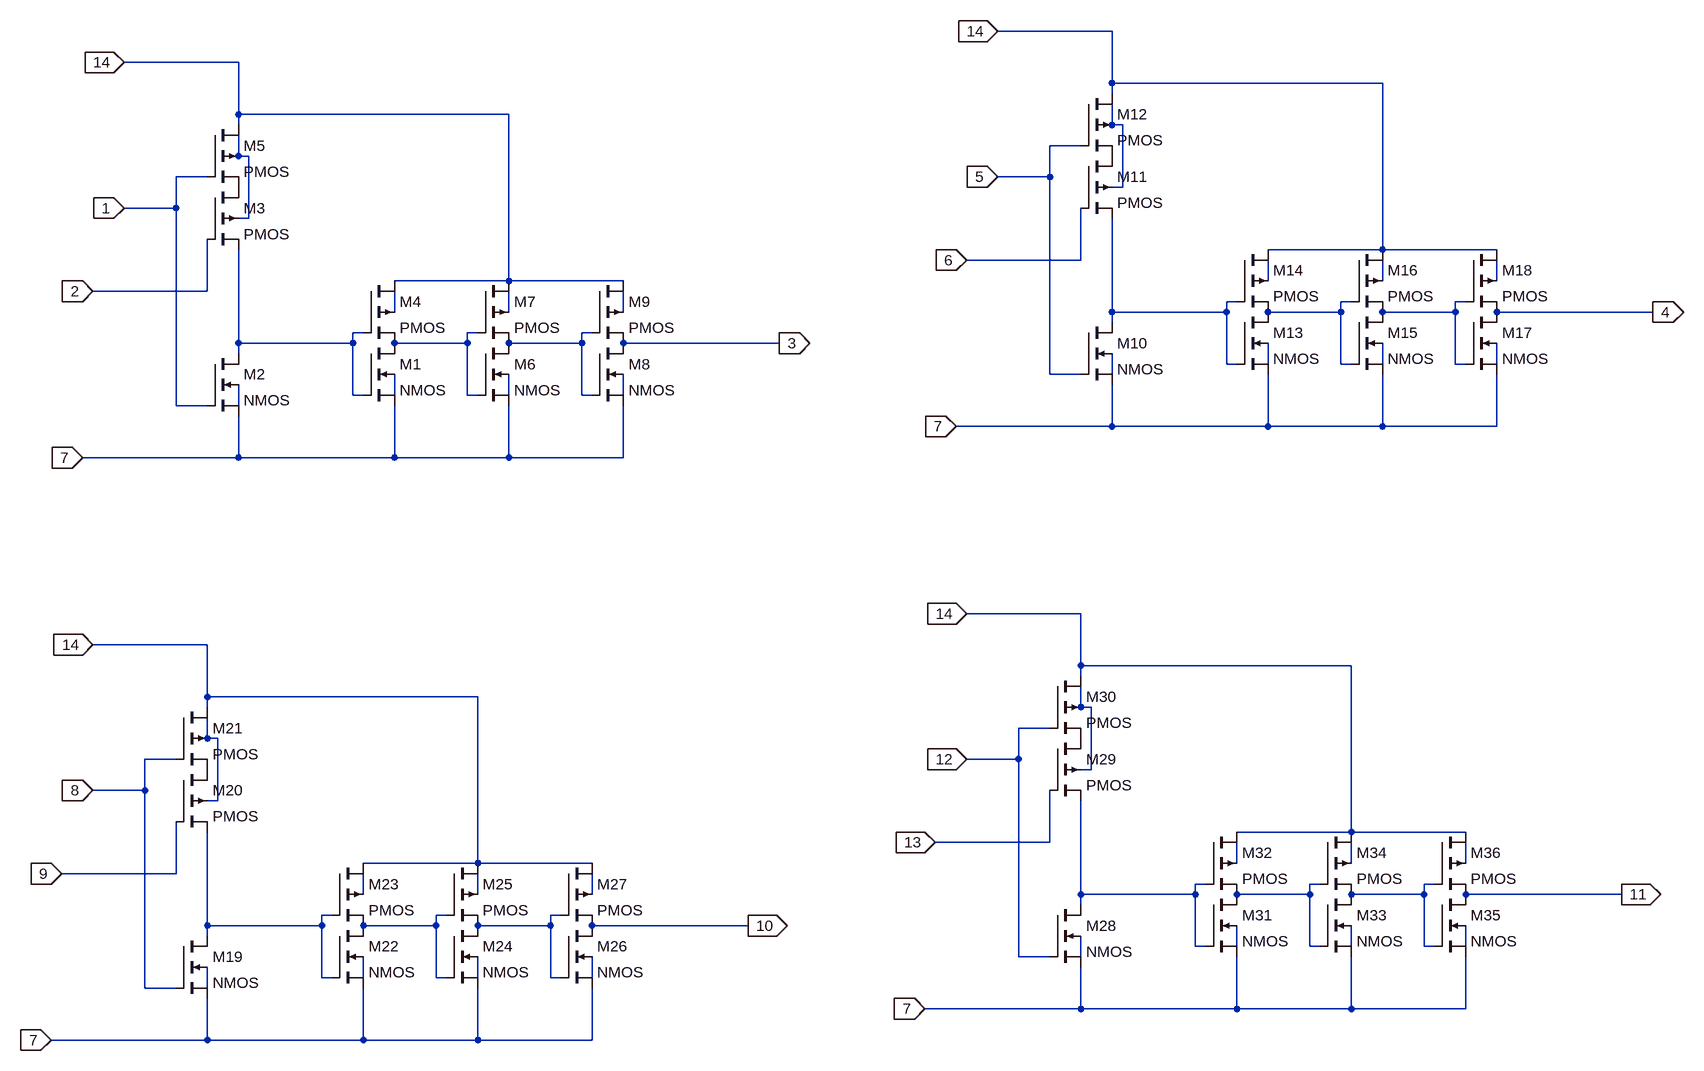
[diagram p0: schematic 4071_OR.asc]
4071_OR.asc, the LTspice schematic file:
Version 4
SHEET 1 2172 1448
WIRE 1264 -176 1088 -176
WIRE -80 -128 -256 -128
WIRE 1264 -96 1264 -176
WIRE 1680 -96 1264 -96
WIRE 1264 -80 1264 -96
WIRE -80 -48 -80 -128
WIRE 336 -48 -80 -48
WIRE -80 -32 -80 -48
WIRE 1264 -32 1264 -64
WIRE 1280 -32 1264 -32
WIRE 1216 0 1168 0
WIRE -80 16 -80 -16
WIRE -64 16 -80 16
WIRE -128 48 -176 48
WIRE 1168 48 1168 0
WIRE 1168 48 1088 48
WIRE 1280 64 1280 -32
WIRE 1280 64 1264 64
WIRE -176 96 -176 48
WIRE -176 96 -256 96
WIRE -64 112 -64 16
WIRE -64 112 -80 112
WIRE 1680 160 1680 -96
WIRE 1680 160 1504 160
WIRE 1856 160 1680 160
WIRE 1216 176 1216 96
WIRE 1216 176 1040 176
WIRE 336 208 336 -48
WIRE 336 208 160 208
WIRE 512 208 336 208
WIRE 1504 208 1504 176
WIRE 1680 208 1680 176
WIRE 1856 208 1856 176
WIRE -128 224 -128 144
WIRE -128 224 -304 224
WIRE 1456 240 1440 240
WIRE 1632 240 1616 240
WIRE 1808 240 1792 240
WIRE 160 256 160 224
WIRE 336 256 336 224
WIRE 512 256 512 224
WIRE 1264 256 1264 112
WIRE 1440 256 1440 240
WIRE 1440 256 1264 256
WIRE 1616 256 1616 240
WIRE 1616 256 1504 256
WIRE 1792 256 1792 240
WIRE 1792 256 1680 256
WIRE 2096 256 1856 256
WIRE 1264 272 1264 256
WIRE 112 288 96 288
WIRE 288 288 272 288
WIRE 464 288 448 288
WIRE -80 304 -80 160
WIRE 96 304 96 288
WIRE 96 304 -80 304
WIRE 272 304 272 288
WIRE 272 304 160 304
WIRE 448 304 448 288
WIRE 448 304 336 304
WIRE 752 304 512 304
WIRE -80 320 -80 304
WIRE 1440 336 1440 256
WIRE 1456 336 1440 336
WIRE 1504 336 1504 304
WIRE 1616 336 1616 256
WIRE 1632 336 1616 336
WIRE 1680 336 1680 304
WIRE 1792 336 1792 256
WIRE 1808 336 1792 336
WIRE 1856 336 1856 304
WIRE 1168 352 1168 48
WIRE 1216 352 1168 352
WIRE 1264 352 1264 320
WIRE 96 384 96 304
WIRE 112 384 96 384
WIRE 160 384 160 352
WIRE 272 384 272 304
WIRE 288 384 272 384
WIRE 336 384 336 352
WIRE 448 384 448 304
WIRE 464 384 448 384
WIRE 512 384 512 352
WIRE -176 400 -176 96
WIRE -128 400 -176 400
WIRE -80 400 -80 368
WIRE 1264 432 1264 368
WIRE 1264 432 1024 432
WIRE 1504 432 1504 352
WIRE 1504 432 1264 432
WIRE 1680 432 1680 352
WIRE 1680 432 1504 432
WIRE 1856 432 1856 352
WIRE 1856 432 1680 432
WIRE -80 480 -80 416
WIRE -80 480 -320 480
WIRE 160 480 160 400
WIRE 160 480 -80 480
WIRE 336 480 336 400
WIRE 336 480 160 480
WIRE 512 480 512 400
WIRE 512 480 336 480
WIRE 1216 720 1040 720
WIRE -128 768 -304 768
WIRE 1216 800 1216 720
WIRE 1632 800 1216 800
WIRE 1216 816 1216 800
WIRE -128 848 -128 768
WIRE 288 848 -128 848
WIRE -128 864 -128 848
WIRE 1216 864 1216 832
WIRE 1232 864 1216 864
WIRE 1168 896 1120 896
WIRE -128 912 -128 880
WIRE -112 912 -128 912
WIRE -176 944 -224 944
WIRE 1120 944 1120 896
WIRE 1120 944 1040 944
WIRE 1232 960 1232 864
WIRE 1232 960 1216 960
WIRE -224 992 -224 944
WIRE -224 992 -304 992
WIRE -112 1008 -112 912
WIRE -112 1008 -128 1008
WIRE 1632 1056 1632 800
WIRE 1632 1056 1456 1056
WIRE 1808 1056 1632 1056
WIRE 1168 1072 1168 992
WIRE 1168 1072 992 1072
WIRE 288 1104 288 848
WIRE 288 1104 112 1104
WIRE 464 1104 288 1104
WIRE 1456 1104 1456 1072
WIRE 1632 1104 1632 1072
WIRE 1808 1104 1808 1072
WIRE -176 1120 -176 1040
WIRE -176 1120 -352 1120
WIRE 1408 1136 1392 1136
WIRE 1584 1136 1568 1136
WIRE 1760 1136 1744 1136
WIRE 112 1152 112 1120
WIRE 288 1152 288 1120
WIRE 464 1152 464 1120
WIRE 1216 1152 1216 1008
WIRE 1392 1152 1392 1136
WIRE 1392 1152 1216 1152
WIRE 1568 1152 1568 1136
WIRE 1568 1152 1456 1152
WIRE 1744 1152 1744 1136
WIRE 1744 1152 1632 1152
WIRE 2048 1152 1808 1152
WIRE 1216 1168 1216 1152
WIRE 64 1184 48 1184
WIRE 240 1184 224 1184
WIRE 416 1184 400 1184
WIRE -128 1200 -128 1056
WIRE 48 1200 48 1184
WIRE 48 1200 -128 1200
WIRE 224 1200 224 1184
WIRE 224 1200 112 1200
WIRE 400 1200 400 1184
WIRE 400 1200 288 1200
WIRE 704 1200 464 1200
WIRE -128 1216 -128 1200
WIRE 1392 1232 1392 1152
WIRE 1408 1232 1392 1232
WIRE 1456 1232 1456 1200
WIRE 1568 1232 1568 1152
WIRE 1584 1232 1568 1232
WIRE 1632 1232 1632 1200
WIRE 1744 1232 1744 1152
WIRE 1760 1232 1744 1232
WIRE 1808 1232 1808 1200
WIRE 1120 1248 1120 944
WIRE 1168 1248 1120 1248
WIRE 1216 1248 1216 1216
WIRE 48 1280 48 1200
WIRE 64 1280 48 1280
WIRE 112 1280 112 1248
WIRE 224 1280 224 1200
WIRE 240 1280 224 1280
WIRE 288 1280 288 1248
WIRE 400 1280 400 1200
WIRE 416 1280 400 1280
WIRE 464 1280 464 1248
WIRE -224 1296 -224 992
WIRE -176 1296 -224 1296
WIRE -128 1296 -128 1264
WIRE 1216 1328 1216 1264
WIRE 1216 1328 976 1328
WIRE 1456 1328 1456 1248
WIRE 1456 1328 1216 1328
WIRE 1632 1328 1632 1248
WIRE 1632 1328 1456 1328
WIRE 1808 1328 1808 1248
WIRE 1808 1328 1632 1328
WIRE -128 1376 -128 1312
WIRE -128 1376 -368 1376
WIRE 112 1376 112 1296
WIRE 112 1376 -128 1376
WIRE 288 1376 288 1296
WIRE 288 1376 112 1376
WIRE 464 1376 464 1296
WIRE 464 1376 288 1376
FLAG -256 96 1
IOPIN -256 96 In
FLAG -256 -128 14
IOPIN -256 -128 In
FLAG -320 480 7
IOPIN -320 480 In
FLAG -304 224 2
IOPIN -304 224 In
FLAG 752 304 3
IOPIN 752 304 Out
FLAG 1088 48 5
IOPIN 1088 48 In
FLAG 1088 -176 14
IOPIN 1088 -176 In
FLAG 1024 432 7
IOPIN 1024 432 In
FLAG 1040 176 6
IOPIN 1040 176 In
FLAG 2096 256 4
IOPIN 2096 256 Out
FLAG -304 992 8
IOPIN -304 992 In
FLAG -304 768 14
IOPIN -304 768 In
FLAG -368 1376 7
IOPIN -368 1376 In
FLAG -352 1120 9
IOPIN -352 1120 In
FLAG 704 1200 10
IOPIN 704 1200 Out
FLAG 1040 944 12
IOPIN 1040 944 In
FLAG 1040 720 14
IOPIN 1040 720 In
FLAG 976 1328 7
IOPIN 976 1328 In
FLAG 992 1072 13
IOPIN 992 1072 In
FLAG 2048 1152 11
IOPIN 2048 1152 Out
SYMBOL nmos4 -128 320 R0
SYMATTR InstName M2
SYMBOL pmos4 -128 64 R0
SYMATTR InstName M3
SYMBOL pmos4 -128 -32 R0
SYMATTR InstName M5
SYMBOL nmos4 112 304 R0
SYMATTR InstName M1
SYMBOL pmos4 112 208 R0
SYMATTR InstName M4
SYMBOL nmos4 288 304 R0
SYMATTR InstName M6
SYMBOL pmos4 288 208 R0
SYMATTR InstName M7
SYMBOL nmos4 464 304 R0
SYMATTR InstName M8
SYMBOL pmos4 464 208 R0
SYMATTR InstName M9
SYMBOL nmos4 1216 272 R0
SYMATTR InstName M10
SYMBOL pmos4 1216 16 R0
SYMATTR InstName M11
SYMBOL pmos4 1216 -80 R0
SYMATTR InstName M12
SYMBOL nmos4 1456 256 R0
SYMATTR InstName M13
SYMBOL pmos4 1456 160 R0
SYMATTR InstName M14
SYMBOL nmos4 1632 256 R0
SYMATTR InstName M15
SYMBOL pmos4 1632 160 R0
SYMATTR InstName M16
SYMBOL nmos4 1808 256 R0
SYMATTR InstName M17
SYMBOL pmos4 1808 160 R0
SYMATTR InstName M18
SYMBOL nmos4 -176 1216 R0
SYMATTR InstName M19
SYMBOL pmos4 -176 960 R0
SYMATTR InstName M20
SYMBOL pmos4 -176 864 R0
SYMATTR InstName M21
SYMBOL nmos4 64 1200 R0
SYMATTR InstName M22
SYMBOL pmos4 64 1104 R0
SYMATTR InstName M23
SYMBOL nmos4 240 1200 R0
SYMATTR InstName M24
SYMBOL pmos4 240 1104 R0
SYMATTR InstName M25
SYMBOL nmos4 416 1200 R0
SYMATTR InstName M26
SYMBOL pmos4 416 1104 R0
SYMATTR InstName M27
SYMBOL nmos4 1168 1168 R0
SYMATTR InstName M28
SYMBOL pmos4 1168 912 R0
SYMATTR InstName M29
SYMBOL pmos4 1168 816 R0
SYMATTR InstName M30
SYMBOL nmos4 1408 1152 R0
SYMATTR InstName M31
SYMBOL pmos4 1408 1056 R0
SYMATTR InstName M32
SYMBOL nmos4 1584 1152 R0
SYMATTR InstName M33
SYMBOL pmos4 1584 1056 R0
SYMATTR InstName M34
SYMBOL nmos4 1760 1152 R0
SYMATTR InstName M35
SYMBOL pmos4 1760 1056 R0
SYMATTR InstName M36

The netlist it stands for:
* 4071_OR.asc
M2 N012 1 7 N022 NMOS
M3 P001 2 N012 N002 PMOS
M5 14 1 P001 N002 PMOS
M1 N013 N012 7 N019 NMOS
M4 14 N012 N013 N009 PMOS
M6 N014 N013 7 N020 NMOS
M7 14 N013 N014 N010 PMOS
M8 3 N014 7 N021 NMOS
M9 14 N014 3 N011 PMOS
M10 N006 5 7 N018 NMOS
M11 P002 6 N006 N001 PMOS
M12 14 5 P002 N001 PMOS
M13 N007 N006 7 N015 NMOS
M14 14 N006 N007 N003 PMOS
M15 N008 N007 7 N016 NMOS
M16 14 N007 N008 N004 PMOS
M17 4 N008 7 N017 NMOS
M18 14 N008 4 N005 PMOS
M19 N034 8 7 N044 NMOS
M20 P003 9 N034 N024 PMOS
M21 14 8 P003 N024 PMOS
M22 N035 N034 7 N041 NMOS
M23 14 N034 N035 N031 PMOS
M24 N036 N035 7 N042 NMOS
M25 14 N035 N036 N032 PMOS
M26 10 N036 7 N043 NMOS
M27 14 N036 10 N033 PMOS
M28 N028 12 7 N040 NMOS
M29 P004 13 N028 N023 PMOS
M30 14 12 P004 N023 PMOS
M31 N029 N028 7 N037 NMOS
M32 14 N028 N029 N025 PMOS
M33 N030 N029 7 N038 NMOS
M34 14 N029 N030 N026 PMOS
M35 11 N030 7 N039 NMOS
M36 14 N030 11 N027 PMOS
.model NMOS NMOS
.model PMOS PMOS
.lib standard.mos
.backanno
.end